# EAGLE schematic CommsTestBoardV2 (EAGLE 9.6.2)
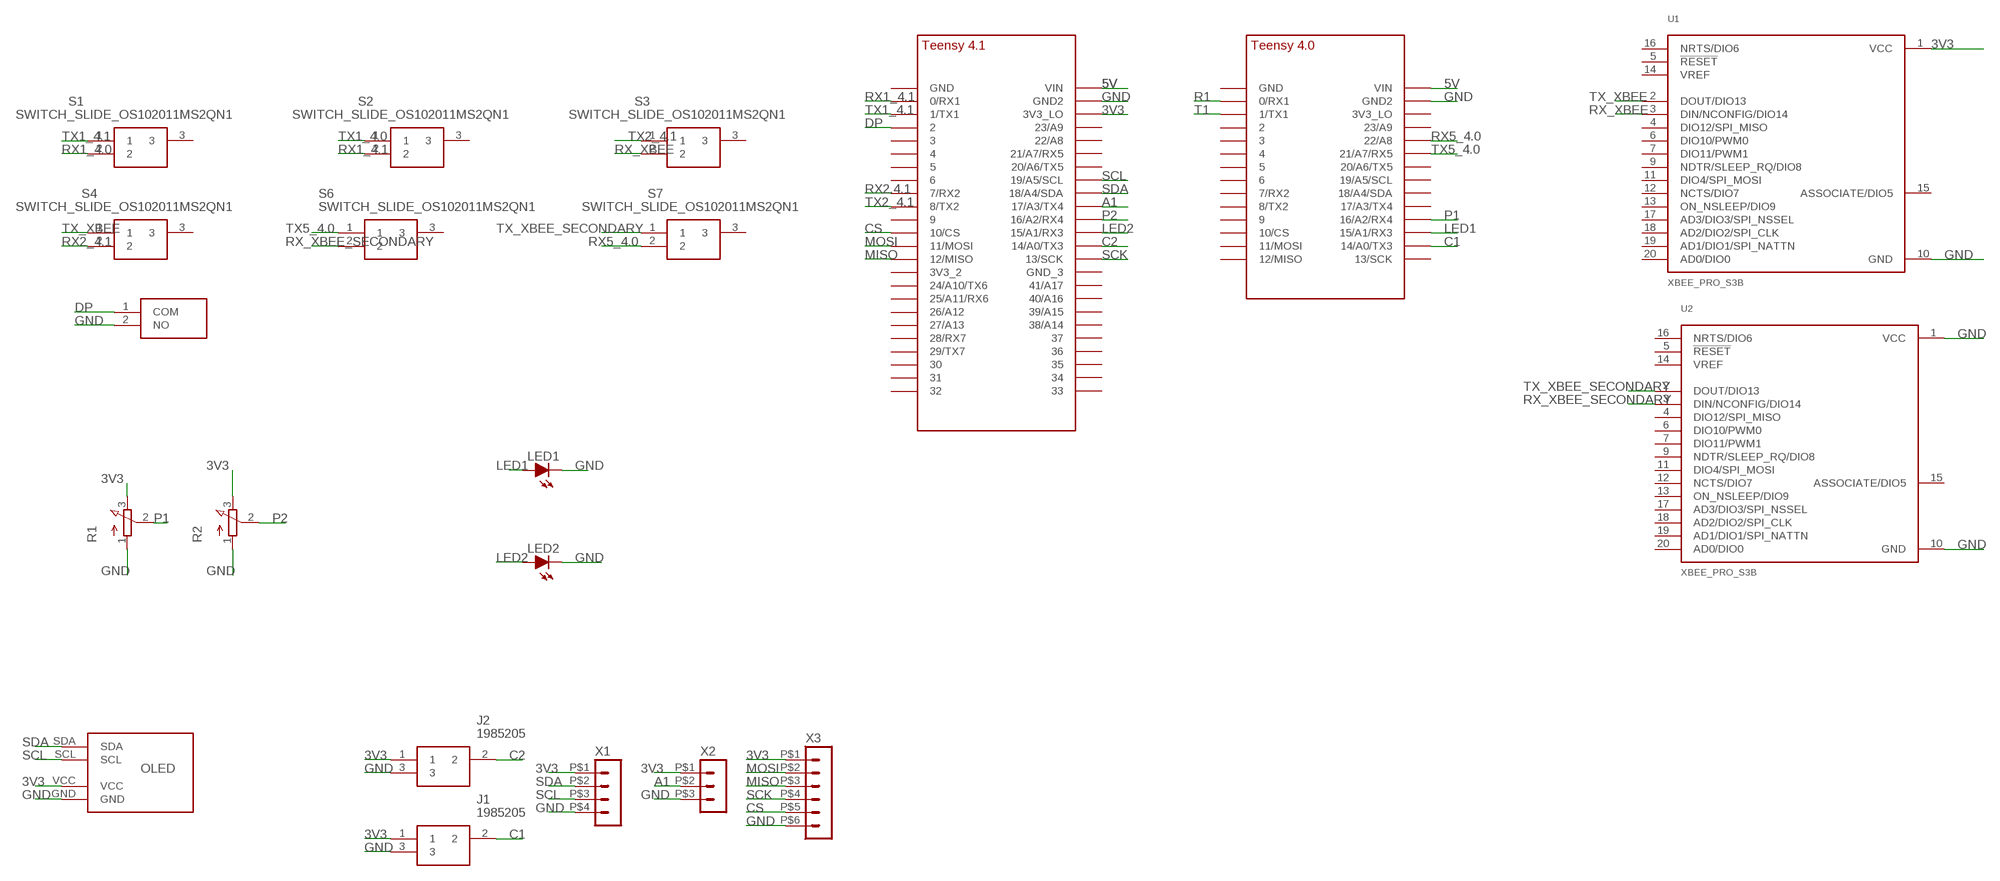
[diagram p0: schematic, sheet 1]

## Parts
J1  1985205  [1985205]
J2  1985205  [1985205]
LED1  LED-5MM  [LED-5MM]
LED2  LED-5MM  [LED-5MM]
R1  POTENTIOMETER  [3RP/1610N]
R2  POTENTIOMETER  [3RP/1610N]
S1  SWITCH_SLIDE_OS102011MS2QN1  [OS102011MA1QN1]
S2  SWITCH_SLIDE_OS102011MS2QN1  [OS102011MA1QN1]
S3  SWITCH_SLIDE_OS102011MS2QN1  [OS102011MA1QN1]
S4  SWITCH_SLIDE_OS102011MS2QN1  [OS102011MA1QN1]
S5  PTS636_SL50_LFS  [PTS636SL50LFS]
S6  SWITCH_SLIDE_OS102011MS2QN1  [OS102011MA1QN1]
S7  SWITCH_SLIDE_OS102011MS2QN1  [OS102011MA1QN1]
U1  XBEE_PRO_S3B  [XBEE_PRO_S3B]
U2  XBEE_PRO_S3B  [XBEE_PRO_S3B]
U$1  TEENSY_4.0_SIMPLE  [TEENSY_4.0_SIMPLE]
U$3  TEENSY_4.1_SIMPLE  [TEENSY_4.1_SIMPLE]
U$4  OLED_SSD1306  [OLED_SSD1306]
X1  HEADER_POS4_43045-0401  [43045-0400]
X2  HEADER_POS3_43650-0300  [43650-0300]
X3  HEADER_POS6_43045-0600  [43045-0600]

## Nets
3V3: J1.1 J2.1 R1.3(E) R2.3(E) U1.1(VCC) U$3.3V3_LO U$4.VCC X1.P$1 X2.P$1 X3.P$1
5V: U$1.VIN U$3.VIN
A1: U$3.17/A3(17/A3/TX4) X2.P$2
C1: J1.2 U$1.14/A0(14/A0/TX3)
C2: J2.2 U$3.14/A0(14/A0/TX3)
CS: U$3.10/CS X3.P$5
DP: S5.1(COM) U$3.2
GND: J1.3 J2.3 LED1.K(C) LED2.K(C) R1.1(A) R2.1(A) S5.2(NO) U1.10(GND) U2.1(VCC) U2.10(GND) U$1.GND2 U$3.GND2 U$4.GND X1.P$4 X2.P$3 X3.P$6
LED1: LED1.A U$1.15/A1(15/A1/RX3)
LED2: LED2.A U$3.15/A1(15/A1/RX3)
MISO: U$3.12/MISO X3.P$3
MOSI: U$3.11/MOSI X3.P$2
P1: R1.2(S) U$1.16/A2(16/A2/RX4)
P2: R2.2(S) U$3.16/A2(16/A2/RX4)
R1: U$1.0/RX(0/RX1)
RX1_4.0: S1.2
RX1_4.1: S2.2 U$3.0/RX(0/RX1)
RX2.4.1: U$3.7(7/RX2)
RX2_4.1: S4.2
RX5_4.0: S7.2 U$1.22/A8
RX_XBEE: S3.2 U1.3(DIN/NCONFIG/DIO14)
RX_XBEE_SECONDARY: S6.2 U2.3(DIN/NCONFIG/DIO14)
SCK: U$3.13/SCK X3.P$4
SCL: U$3.19/A5/SCL U$4.SCL X1.P$3
SDA: U$3.18/A4/SDA U$4.SDA X1.P$2
T1: U$1.1/TX(1/TX1)
TX1_4.0: S2.1
TX1_4.1: S1.1 U$3.1/TX(1/TX1)
TX2_4.1: S3.1 U$3.8(8/TX2)
TX5_4.0: S6.1 U$1.21/A7(21/A7/RX5)
TX_XBEE: S4.1 U1.2(DOUT/DIO13)
TX_XBEE_SECONDARY: S7.1 U2.2(DOUT/DIO13)
Unconnected: S1.3 S2.3 S3.3 S4.3 S6.3 S7.3 U1.4(DIO12/SPI_MISO) U1.5(!RESET) U1.6(DIO10/PWM0) U1.7(DIO11/PWM1) U1.9(NDTR/SLEEP_RQ/DIO8) U1.11(DIO4/SPI_MOSI) U1.12(NCTS/DIO7) U1.13(ON_NSLEEP/DIO9) U1.14(VREF) U1.15(ASSOCIATE/DIO5) U1.16(NRTS/DIO6) U1.17(AD3/DIO3/SPI_NSSEL) U1.18(AD2/DIO2/SPI_CLK) U1.19(AD1/DIO1/SPI_NATTN) U1.20(AD0/DIO0) U2.4(DIO12/SPI_MISO) U2.5(!RESET) U2.6(DIO10/PWM0) U2.7(DIO11/PWM1) U2.9(NDTR/SLEEP_RQ/DIO8) U2.11(DIO4/SPI_MOSI) U2.12(NCTS/DIO7) U2.13(ON_NSLEEP/DIO9) U2.14(VREF) U2.15(ASSOCIATE/DIO5) U2.16(NRTS/DIO6) U2.17(AD3/DIO3/SPI_NSSEL) U2.18(AD2/DIO2/SPI_CLK) U2.19(AD1/DIO1/SPI_NATTN) U2.20(AD0/DIO0) U$1.2 U$1.3/CANTX U$1.3V3_LO U$1.4/CANRX U$1.5 U$1.6 U$1.7(7/RX2) U$1.8(8/TX2) U$1.9/CS U$1.10/CS U$1.11/MOSI U$1.12/MISO U$1.13/SCK U$1.17/A3(17/A3/TX4) U$1.18/A4/SDA U$1.19/A5/SCL U$1.20/A6(20/A6/TX5) U$1.23/A9 U$1.GND U$3.3/CANTX U$3.3V3_2 U$3.4/CANRX U$3.5 U$3.6 U$3.9/CS U$3.20/A6(20/A6/TX5) U$3.21/A7(21/A7/RX5) U$3.22/A8 U$3.23/A9 U$3.24/A10(24/A10/TX6) U$3.25/A11(25/A11/RX6) U$3.26/A12 U$3.27/A13 U$3.28(28/RX7) U$3.29(29/TX7) U$3.30 U$3.31 U$3.32 U$3.33 U$3.34 U$3.35 U$3.36 U$3.37 U$3.38/A14 U$3.39/A15 U$3.40/A16 U$3.41/A17 U$3.GND U$3.GND3(GND_3)

## Library data of the parts
J1 J2 = GTOR - Connectors:1985205: Fixed Terminal Blocks PTSA 1.5/3-3.5-Z Source: Datasheet <https://componentsearchengine.com/Datasheets/1/1985205.pdf>; ARROW_PART_NUMBER: 1985205; ARROW_PRICE-STOCK: https://www.arrow.com/en/products/1985205/phoenix-contact; DESCRIPTION: Fixed Terminal Blocks PTSA 1.5/3-3.5-Z; HEIGHT: 13mm; MANUFACTURER_NAME: Phoenix Contact; MANUFACTURER_PART_NUMBER: 1985205; MOUSER_PART_NUMBER: 651-1985205; MOUSER_PRICE-STOCK: https://www.mouser.co.uk/ProductDetail/Phoenix-Contact/1985205?qs=JcjeNNoqGSNoFnucoMlHJQ%3D%3D
LED1 LED2 = GTOR - Passive Components:LED: Light Emitting Diode (LED) Source: Dangerous Prototypes Eagle Library <https://github.com/DangerousPrototypes/Eagle_Part_Library>
R1 R2 = GTOR - Passive Components:POTENTIOMETER: 16mm Potentiometer one level Source: http://www.alphapotentiometers.net/html/16mm_pot_2.html
S1-S4 S6 S7 = GTOR - Active Components:SWITCH_SLIDE_OS102011MS2QN1: Switch Slide Miniature SPDT 0.1A 12VDC Through Hole Slide Switch SPDT On-On 0.1 A@ 12 V dc Slide Source: Datasheet <http://www.ckswitches.com/media/1428/os.pdf>; ARROW_PART_NUMBER: OS102011MS2QN1; ARROW_PRICE-STOCK: https://www.arrow.com/en/products/os102011ms2qn1/ck; DESCRIPTION: Switch Slide Miniature SPDT 0.1A 12VDC Through Hole Slide Switch SPDT On-On 0.1 A@ 12 V dc Slide; HEIGHT: mm; MANUFACTURER_NAME: C & K COMPONENTS; MANUFACTURER_PART_NUMBER: OS102011MS2QN1; MOUSER_PART_NUMBER: 611-OS102011MS2QN1; MOUSER_PRICE-STOCK: https://www.mouser.co.uk/ProductDetail/CK/OS102011MS2QN1?qs=WtljUlYws5RvQ1hEv876nQ%3D%3D
S5 = GTOR - Active Components:PTS636_SL50_LFS: Tactile Switches Tact 50mA 12VDC, 6.0x3.5, 5.0mm H, 130gf, THT leads, Black Actuator Source: Datasheet <https://componentsearchengine.com/Datasheets/1/PTS636 SL50 LFS.pdf>; ARROW_PART_NUMBER: PTS636 SL50 LFS; ARROW_PRICE-STOCK: https://www.arrow.com/en/products/pts636-sl50-lfs/ck; DESCRIPTION: Tactile Switches Tact 50mA 12VDC, 6.0x3.5, 5.0mm H, 130gf, THT leads, Black Actuator; HEIGHT: 5.2mm; MANUFACTURER_NAME: C & K COMPONENTS; MANUFACTURER_PART_NUMBER: PTS636 SL50 LFS; MOUSER_PART_NUMBER: 611-PTS636SL50LFS; MOUSER_PRICE-STOCK: https://www.mouser.co.uk/ProductDetail/CK/PTS636-SL50-LFS?qs=vLWxofP3U2xbACAJDYC1Hw%3D%3D
U1 U2 = GTOR - Microcontroller:XBEE_PRO_S3B: XBee-PRO 900HP DigiMesh 900 MHz 200 Kbps RF Module with U.FL Connector; DESCRIPTION: General ISM < 1GHz Transceiver Module 900MHz Antenna Not Included, RP-SMA Through Hole; DIGI-KEY_PART_NUMBER: 602-1293-ND; MF: Digi International; MP: XBP9B-XCST-001; PACKAGE: Module Digi International
U$1 = GTOR - Microcontroller:TEENSY_4.0_SIMPLE
U$3 = GTOR - Microcontroller:TEENSY_4.1_SIMPLE
U$4 = GTOR - Breakout Boards:OLED_SSD1306
X1 = GTOR - Microfit Connector:HEADER_POS4_?: Molex - Micro-Fit 3.0 Series connector, 3.00mm (0.118") pitch header, 4 positions.
X2 = GTOR - Microfit Connector:HEADER_POS3_?: Molex - Micro-Fit 3.0 Series connector, 3.00mm (0.118") pitch header, 3 positions.
X3 = GTOR - Microfit Connector:HEADER_POS6_?: Molex - Micro-Fit 3.0 Series connector, 3.00mm (0.118") pitch header, 6 positions.